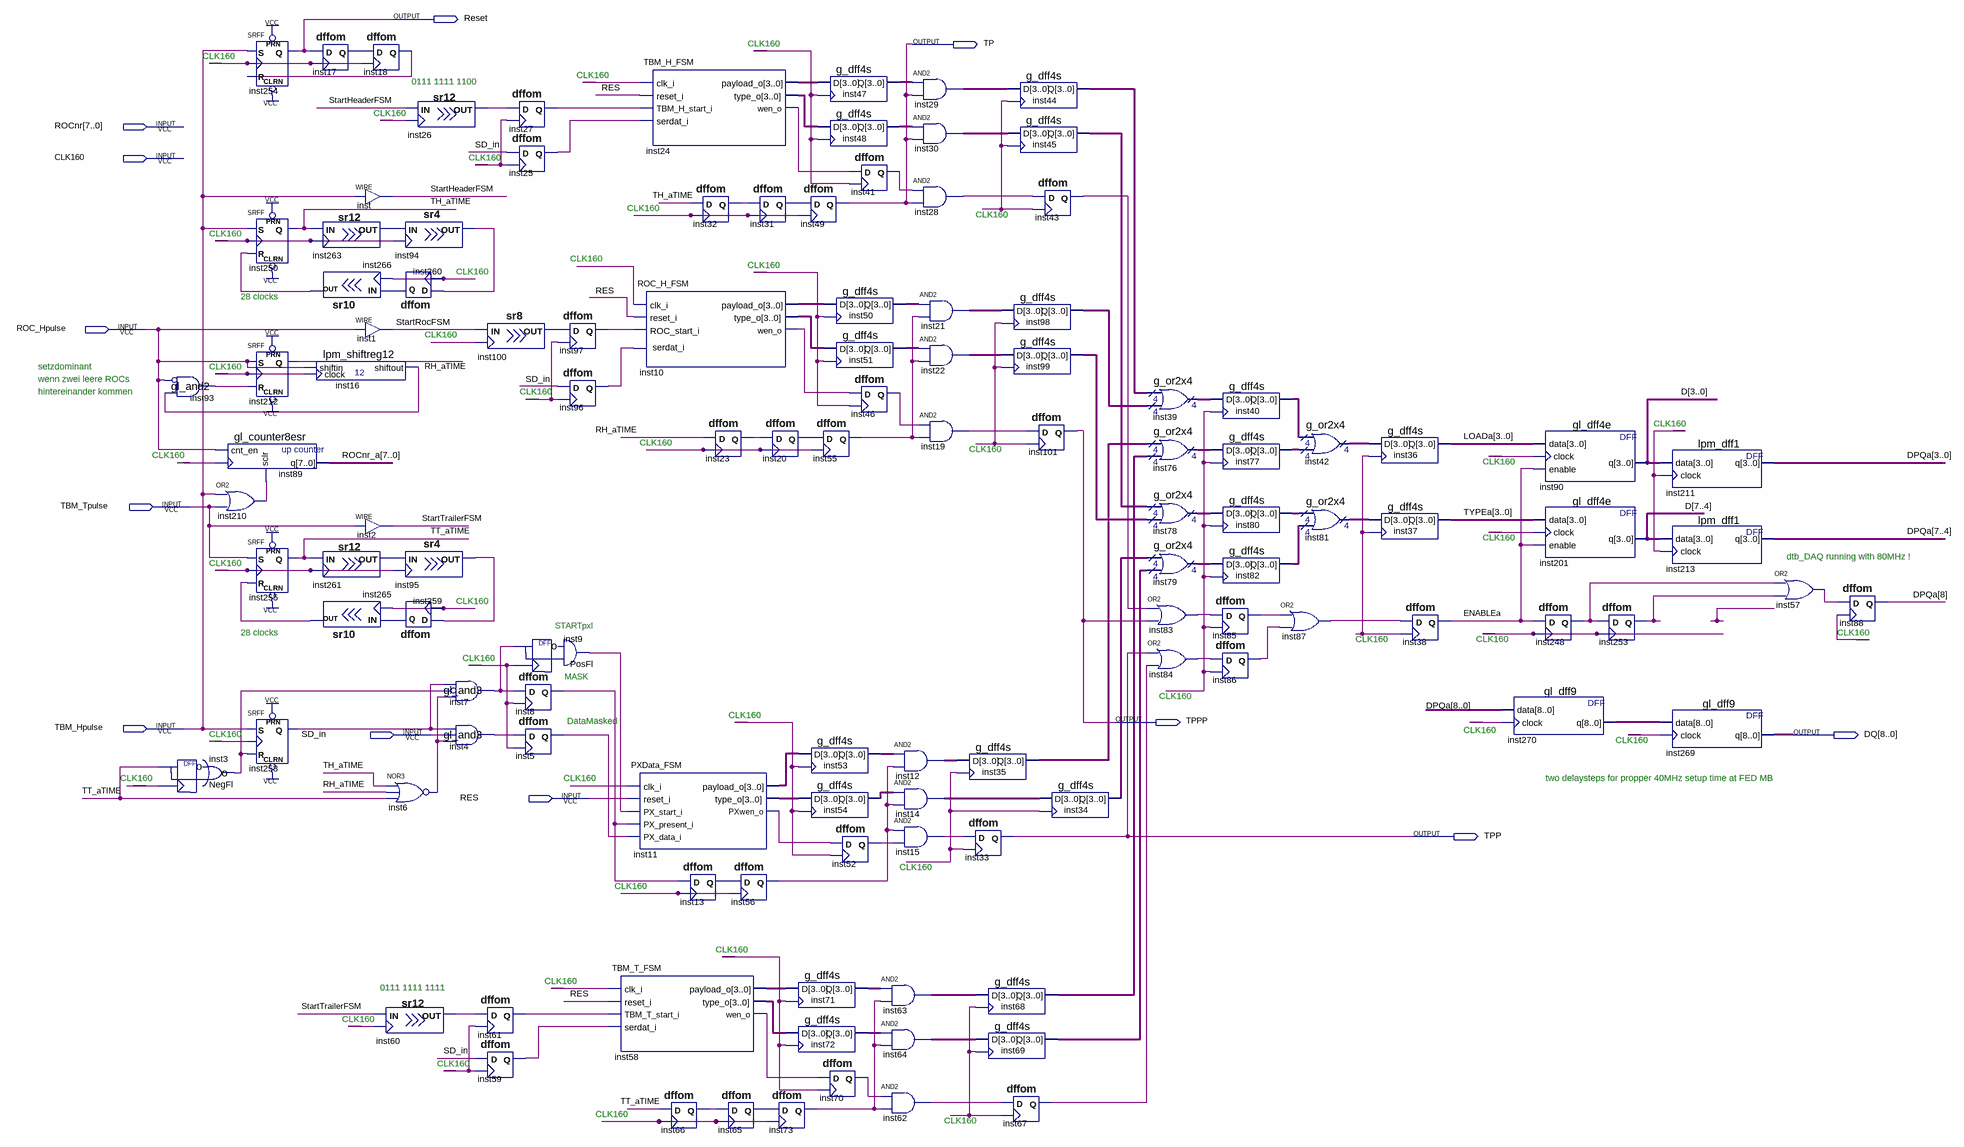
[diagram p0: schematic sheet]
// Quartus schematic FormatFSM.bdf as structural Verilog: 117 symbols, 12 pins
module FormatFSM (
  input  [7:0] ROCnr,
  input  CLK160,
  input  ROC_Hpulse,
  input  TBM_Tpulse,
  input  TBM_Hpulse,
  input  SD_in,
  input  RES,
  output Reset,
  output TP,
  output TPPP,
  output [8:0] DQ,
  output TPP
);

  wire ENABLEa, inst3_out, inst4_result, inst5_q, inst6_out, inst7_result, inst8_q, inst9_out, inst10_wen_o,
       inst11_pxwen_o, inst13_q, inst15_out, inst16_shiftout, inst17_q, inst18_q, inst19_out, inst20_q,
       inst23_q, inst24_wen_o, inst25_q, inst26_out, inst27_q, inst28_out, inst31_q, inst32_q, inst41_q,
       inst43_q, inst46_q, inst52_q, inst55_q, inst56_q, inst57_out, inst58_wen_o, inst59_q, inst60_out,
       inst61_q, inst62_out, inst65_q, inst66_q, inst67_q, inst70_q, inst73_q, inst83_out, inst84_out,
       inst85_q, inst86_q, inst87_out, inst93_result, inst94_out, inst95_out, inst96_q, inst97_q,
       inst100_out, inst210_out, inst248_q, inst253_q, inst258_q, inst259_q, inst260_q, inst261_out,
       inst263_out, inst265_out, inst266_out, RH_aTIME, StartHeaderFSM, StartRocFSM, StartTrailerFSM,
       TH_aTIME, TT_aTIME;
  wire [3:0] inst10_payload_o, inst10_type_o, inst11_payload_o, inst11_type_o, inst12_out, inst14_out,
       inst21_out, inst22_out, inst24_payload_o, inst24_type_o, inst29_out, inst30_out, inst34_q, inst35_q,
       inst39_result, inst40_q, inst42_result, inst44_q, inst45_q, inst47_q, inst48_q, inst50_q, inst51_q,
       inst53_q, inst54_q, inst58_payload_o, inst58_type_o, inst63_out, inst64_out, inst68_q, inst69_q,
       inst71_q, inst72_q, inst76_result, inst77_q, inst78_result, inst79_result, inst80_q, inst81_result,
       inst82_q, inst98_q, inst99_q, LOADa, TYPEa;
  wire [7:0] D, ROCnr_a;
  wire [8:0] DPQa, inst270_q;

  gl_and2 inst93 (.data0(~ROC_Hpulse), .data1(inst16_shiftout), .result(inst93_result));
  NegFl inst3 (.CK(CLK160), .IN(TT_aTIME), .OUT(inst3_out));
  gl_counter8esr inst89 (.cnt_en(ROC_Hpulse), .clock(CLK160), .sclr(inst210_out), .q(ROCnr_a));
  or inst210 (inst210_out, TBM_Hpulse, TBM_Tpulse);
  SRFF inst254 (.PRN(1'b1), .CLRN(1'b1), .S(TBM_Hpulse), .R(inst18_q), .CLK(CLK160), .Q(Reset));
  SRFF inst250 (.PRN(1'b1), .CLRN(1'b1), .S(TBM_Hpulse), .R(inst266_out), .CLK(CLK160), .Q(TH_aTIME));
  SRFF inst212 (.PRN(1'b1), .CLRN(1'b1), .S(ROC_Hpulse), .R(inst93_result), .CLK(CLK160), .Q(RH_aTIME));
  SRFF inst255 (.PRN(1'b1), .CLRN(1'b1), .S(TBM_Tpulse), .R(inst265_out), .CLK(CLK160), .Q(TT_aTIME));
  SRFF inst258 (.PRN(1'b1), .CLRN(1'b1), .S(TBM_Hpulse), .R(inst3_out), .CLK(CLK160), .Q(inst258_q));
  dffom inst17 (.D(Reset), .CK(CLK160), .Q(inst17_q));
  sr12 inst263 (.IN(TH_aTIME), .CLK(CLK160), .OUT(inst263_out));
  sr10 inst266 (.IN(inst260_q), .CLK(CLK160), .OUT(inst266_out));
  lpm_shiftreg12 inst16 (.clock(CLK160), .shiftin(ROC_Hpulse), .shiftout(inst16_shiftout));
  sr12 inst261 (.IN(TT_aTIME), .CLK(CLK160), .OUT(inst261_out));
  sr10 inst265 (.IN(inst259_q), .CLK(CLK160), .OUT(inst265_out));
  dffom inst18 (.D(inst17_q), .CK(CLK160), .Q(inst18_q));
  assign StartHeaderFSM = TBM_Hpulse;  // WIRE inst
  assign StartRocFSM = ROC_Hpulse;  // WIRE inst1
  assign StartTrailerFSM = TBM_Tpulse;  // WIRE inst2
  nor inst6 (inst6_out, TH_aTIME, RH_aTIME, TT_aTIME);
  sr12 inst60 (.IN(StartTrailerFSM), .CLK(CLK160), .OUT(inst60_out));
  sr12 inst26 (.IN(StartHeaderFSM), .CLK(CLK160), .OUT(inst26_out));
  sr4 inst94 (.IN(inst263_out), .CLK(CLK160), .OUT(inst94_out));
  dffom inst260 (.D(inst94_out), .CK(CLK160), .Q(inst260_q));
  sr4 inst95 (.IN(inst261_out), .CLK(CLK160), .OUT(inst95_out));
  dffom inst259 (.D(inst95_out), .CK(CLK160), .Q(inst259_q));
  sr8 inst100 (.IN(StartRocFSM), .CLK(CLK160), .OUT(inst100_out));
  gl_and3 inst7 (.data0(inst258_q), .data1(~inst3_out), .data2(inst6_out), .result(inst7_result));
  gl_and3 inst4 (.data0(inst258_q), .data1(SD_in), .data2(inst6_out), .result(inst4_result));
  dffom inst61 (.D(inst60_out), .CK(CLK160), .Q(inst61_q));
  dffom inst59 (.D(SD_in), .CK(CLK160), .Q(inst59_q));
  dffom inst27 (.D(inst26_out), .CK(CLK160), .Q(inst27_q));
  dffom inst25 (.D(SD_in), .CK(CLK160), .Q(inst25_q));
  PosFl inst9 (.CK(CLK160), .IN(inst7_result), .OUT(inst9_out));
  dffom inst8 (.D(inst7_result), .CK(CLK160), .Q(inst8_q));
  dffom inst5 (.D(inst4_result), .CK(CLK160), .Q(inst5_q));
  dffom inst97 (.D(inst100_out), .CK(CLK160), .Q(inst97_q));
  dffom inst96 (.D(SD_in), .CK(CLK160), .Q(inst96_q));
  TBM_H_FSM inst24 (
    .clk_i(CLK160), .reset_i(RES), .TBM_H_start_i(inst27_q), .serdat_i(inst25_q),
    .payload_o(inst24_payload_o), .type_o(inst24_type_o), .wen_o(inst24_wen_o));
  ROC_H_FSM inst10 (
    .clk_i(CLK160), .reset_i(RES), .ROC_start_i(inst97_q), .serdat_i(inst96_q), .payload_o(inst10_payload_o),
    .type_o(inst10_type_o), .wen_o(inst10_wen_o));
  PXData_FSM inst11 (
    .clk_i(CLK160), .reset_i(RES), .PX_start_i(inst9_out), .PX_present_i(inst8_q), .PX_data_i(inst5_q),
    .payload_o(inst11_payload_o), .type_o(inst11_type_o), .PXwen_o(inst11_pxwen_o));
  TBM_T_FSM inst58 (
    .clk_i(CLK160), .reset_i(RES), .TBM_T_start_i(inst61_q), .serdat_i(inst59_q),
    .payload_o(inst58_payload_o), .type_o(inst58_type_o), .wen_o(inst58_wen_o));
  dffom inst32 (.D(TH_aTIME), .CK(CLK160), .Q(inst32_q));
  dffom inst13 (.D(inst8_q), .CK(CLK160), .Q(inst13_q));
  dffom inst66 (.D(TT_aTIME), .CK(CLK160), .Q(inst66_q));
  dffom inst23 (.D(RH_aTIME), .CK(CLK160), .Q(inst23_q));
  dffom inst56 (.D(inst13_q), .CK(CLK160), .Q(inst56_q));
  dffom inst65 (.D(inst66_q), .CK(CLK160), .Q(inst65_q));
  dffom inst31 (.D(inst32_q), .CK(CLK160), .Q(inst31_q));
  dffom inst20 (.D(inst23_q), .CK(CLK160), .Q(inst20_q));
  g_dff4s inst71 (.data(inst58_payload_o), .clock(CLK160), .q(inst71_q));
  g_dff4s inst72 (.data(inst58_type_o), .clock(CLK160), .q(inst72_q));
  dffom inst73 (.D(inst65_q), .CK(CLK160), .Q(inst73_q));
  g_dff4s inst47 (.data(inst24_payload_o), .clock(CLK160), .q(inst47_q));
  g_dff4s inst48 (.data(inst24_type_o), .clock(CLK160), .q(inst48_q));
  dffom inst49 (.D(inst31_q), .CK(CLK160), .Q(TP));
  g_dff4s inst50 (.data(inst10_payload_o), .clock(CLK160), .q(inst50_q));
  g_dff4s inst51 (.data(inst10_type_o), .clock(CLK160), .q(inst51_q));
  dffom inst55 (.D(inst20_q), .CK(CLK160), .Q(inst55_q));
  g_dff4s inst53 (.data(inst11_payload_o), .clock(CLK160), .q(inst53_q));
  g_dff4s inst54 (.data(inst11_type_o), .clock(CLK160), .q(inst54_q));
  dffom inst52 (.D(inst11_pxwen_o), .CK(CLK160), .Q(inst52_q));
  dffom inst70 (.D(inst58_wen_o), .CK(CLK160), .Q(inst70_q));
  dffom inst41 (.D(inst24_wen_o), .CK(CLK160), .Q(inst41_q));
  dffom inst46 (.D(inst10_wen_o), .CK(CLK160), .Q(inst46_q));
  assign inst12_out = inst53_q & {4{inst56_q}};  // AND2 inst12, 4 bits wide
  assign inst14_out = inst54_q & {4{inst56_q}};  // AND2 inst14, 4 bits wide
  and inst15 (inst15_out, inst56_q, inst52_q);
  assign inst63_out = inst71_q & {4{inst73_q}};  // AND2 inst63, 4 bits wide
  assign inst64_out = inst72_q & {4{inst73_q}};  // AND2 inst64, 4 bits wide
  and inst62 (inst62_out, inst70_q, inst73_q);
  assign inst29_out = inst47_q & {4{TP}};  // AND2 inst29, 4 bits wide
  assign inst30_out = inst48_q & {4{TP}};  // AND2 inst30, 4 bits wide
  and inst28 (inst28_out, inst41_q, TP);
  assign inst21_out = inst50_q & {4{inst55_q}};  // AND2 inst21, 4 bits wide
  assign inst22_out = inst51_q & {4{inst55_q}};  // AND2 inst22, 4 bits wide
  and inst19 (inst19_out, inst46_q, inst55_q);
  g_dff4s inst35 (.data(inst12_out), .clock(CLK160), .q(inst35_q));
  dffom inst33 (.D(inst15_out), .CK(CLK160), .Q(TPP));
  g_dff4s inst68 (.data(inst63_out), .clock(CLK160), .q(inst68_q));
  g_dff4s inst69 (.data(inst64_out), .clock(CLK160), .q(inst69_q));
  g_dff4s inst44 (.data(inst29_out), .clock(CLK160), .q(inst44_q));
  g_dff4s inst45 (.data(inst30_out), .clock(CLK160), .q(inst45_q));
  dffom inst43 (.D(inst28_out), .CK(CLK160), .Q(inst43_q));
  g_dff4s inst98 (.data(inst21_out), .clock(CLK160), .q(inst98_q));
  g_dff4s inst99 (.data(inst22_out), .clock(CLK160), .q(inst99_q));
  dffom inst101 (.D(inst19_out), .CK(CLK160), .Q(TPPP));
  g_dff4s inst34 (.data(inst14_out), .clock(CLK160), .q(inst34_q));
  dffom inst67 (.D(inst62_out), .CK(CLK160), .Q(inst67_q));
  g_or2x4 inst39 (.data0x(inst44_q), .data1x(inst98_q), .result(inst39_result));
  g_or2x4 inst76 (.data0x(inst35_q), .data1x(inst68_q), .result(inst76_result));
  g_or2x4 inst78 (.data0x(inst45_q), .data1x(inst99_q), .result(inst78_result));
  g_or2x4 inst79 (.data0x(inst34_q), .data1x(inst69_q), .result(inst79_result));
  or inst83 (inst83_out, inst43_q, TPPP);
  or inst84 (inst84_out, TPP, inst67_q);
  g_dff4s inst40 (.data(inst39_result), .clock(CLK160), .q(inst40_q));
  g_dff4s inst77 (.data(inst76_result), .clock(CLK160), .q(inst77_q));
  g_dff4s inst80 (.data(inst78_result), .clock(CLK160), .q(inst80_q));
  g_dff4s inst82 (.data(inst79_result), .clock(CLK160), .q(inst82_q));
  dffom inst85 (.D(inst83_out), .CK(CLK160), .Q(inst85_q));
  dffom inst86 (.D(inst84_out), .CK(CLK160), .Q(inst86_q));
  g_or2x4 inst42 (.data0x(inst40_q), .data1x(inst77_q), .result(inst42_result));
  g_or2x4 inst81 (.data0x(inst80_q), .data1x(inst82_q), .result(inst81_result));
  or inst87 (inst87_out, inst85_q, inst86_q);
  g_dff4s inst36 (.data(inst42_result), .clock(CLK160), .q(LOADa));
  g_dff4s inst37 (.data(inst81_result), .clock(CLK160), .q(TYPEa));
  dffom inst38 (.D(inst87_out), .CK(CLK160), .Q(ENABLEa));
  gl_dff9 inst270 (.data(DPQa), .clock(CLK160), .q(inst270_q));
  gl_dff4e inst90 (.data(LOADa), .clock(CLK160), .enable(ENABLEa), .q(D[3:0]));
  gl_dff4e inst201 (.data(TYPEa), .clock(CLK160), .enable(ENABLEa), .q(D[7:4]));
  dffom inst248 (.D(ENABLEa), .CK(CLK160), .Q(inst248_q));
  dffom inst253 (.D(inst248_q), .CK(CLK160), .Q(inst253_q));
  lpm_dff1 inst211 (.data(D[3:0]), .clock(CLK160), .q(DPQa[3:0]));
  lpm_dff1 inst213 (.data(D[7:4]), .clock(CLK160), .q(DPQa[7:4]));
  gl_dff9 inst269 (.data(inst270_q), .clock(CLK160), .q(DQ));
  or inst57 (inst57_out, inst248_q, inst253_q);
  dffom inst88 (.D(inst57_out), .CK(CLK160), .Q(DPQa[8]));

  // Notes on the sheet:
  //   0111 1111 1100
  //   28 clocks
  //   setzdominant
  //   wenn zwei leere ROCs
  //   hintereinander kommen
  //   dtb_DAQ running with 80MHz !
  //   STARTpxl
  //   28 clocks
  //   MASK
  //   DataMasked
  //   two delaysteps for propper 40MHz setup time at FED MB
  //   0111 1111 1111
endmodule
